# EAGLE design Carriage Minifit PCB (EAGLE 9.6.2)
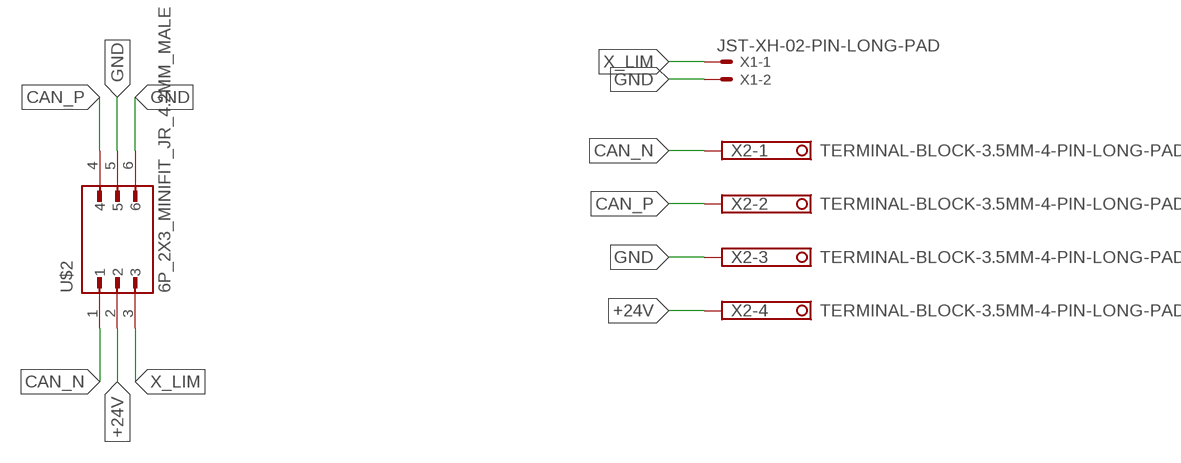
[diagram p0: schematic, sheet 1]

## Parts
U$2  6P_2X3_MINIFIT_JR_4.2MM_MALE  [6P_2X3_MINIFIT_JR_4.2MM_MALE]
X1  JST-XH-02-PIN-LONG-PAD  [JST-XH-02-PACKAGE-LONG-PAD]
X2  TERMINAL-BLOCK-3.5MM-4-PIN-LONG-PAD  [TERMINAL-BLOCK-4-PIN-3.5MM-LONG-PAD]

## Nets
+24V: U$2.2 X2.4
CAN_N [CAN Bus]: U$2.1 X2.1
CAN_P [CAN Bus]: U$2.4 X2.2
GND: U$2.5 U$2.6 X1.2 X2.3
X_LIM: U$2.3 X1.1

## Library data of the parts
U$2 = 6P_2x3_Minifit_Jr_4.2mm_Male:6P_2X3_MINIFIT_JR_4.2MM_MALE
X1 = Rembrandt Electronics - JST XH Connectors v1-0:JST-XH-02-PIN: JST XH Connector 2 Pin Wire to board connector. Pitch: 2,54 mm, (0.100") Number of pins: 2 Created by Rembrandt Electronics www.rembrandtelectronics.com
X2 = Rembrandt Electronics - Terminal Block 3-5mm v1-0:TERMINAL-BLOCK-3.5MM-4-PIN: Terminal Block 3.5mm Pitch: 3,5 mm Number of pins: 4 Created by Rembrandt Electronics www.rembrandtelectronics.com

## Board
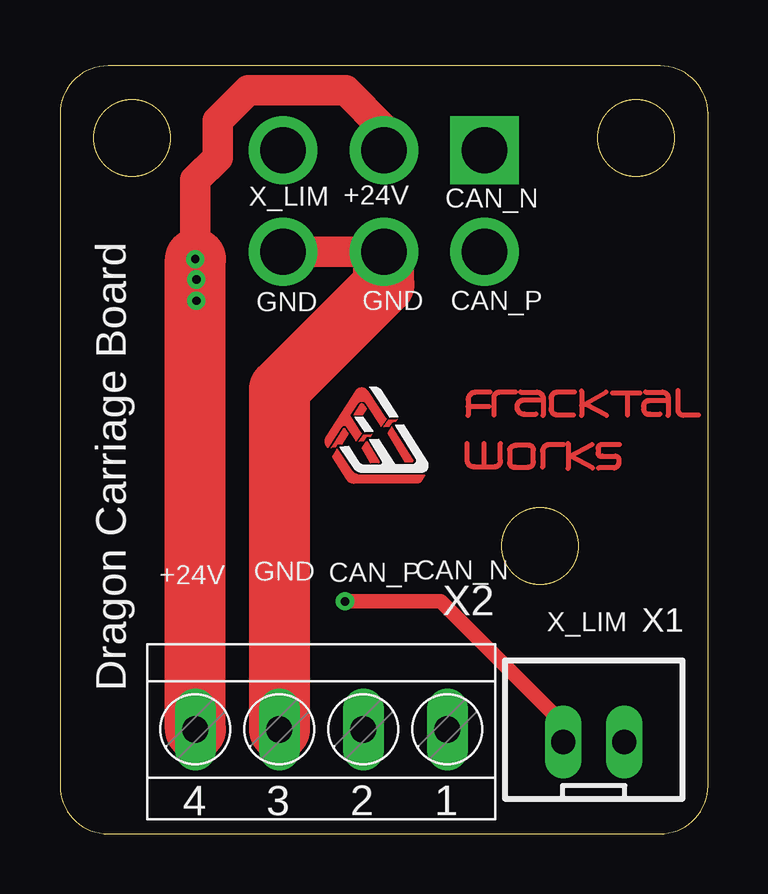
[diagram p1: board, top side]
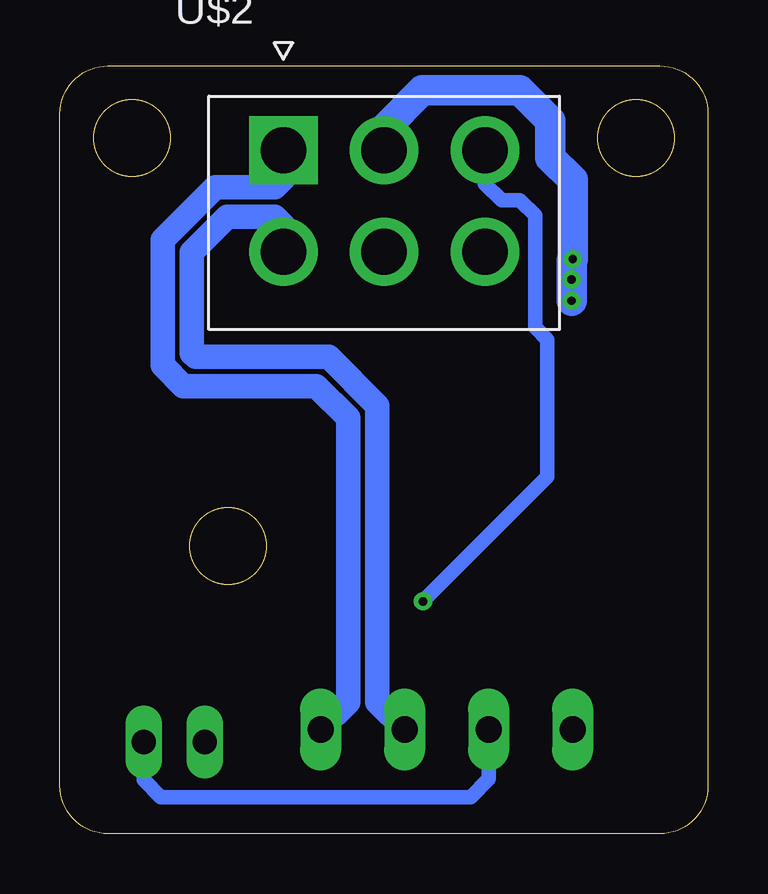
[diagram p2: board, bottom side, seen from below]

Size 27 x 32 mm. Coordinates in mm from the lower left corner, seen from the top.
Outline: 25,0 arc90 27,2 27,30 arc90 25,32 2,32 arc90 0,30 0,2 arc90 2,0 25,0
Outline: circle at 20,12 radius 1.6
Outline: circle at 24,29 radius 1.6
Outline: circle at 3,29 radius 1.6
Copper layers (1*16): Top 0.035mm / dielectric 1.5mm / Bottom 0.035mm
Design rules "LionCircuits *": minimum track width 8mil, minimum drill 0.35mm, track to track 8mil, track to pad 8mil, pad to pad 8mil, via to via 8mil, smd to smd 8mil, copper to edge 10mil, drill to drill 10mil, minimum pad ring 10mil, minimum via ring 8mil, stop-mask expansion 4mil, vias tented up to drill 0mil, thermal gap 10mil

### Footprints (pad centres in the part's own frame; a part is rotated, then mirrored left to right if it is on the bottom)
6P_2X3_MINIFIT_JR_4.2MM_MALE = drill 1.9 pad 2.4 square: 1 0,0 | drill 1.9 pad 2.4: 2 4.2,0; 3 8.4,0; 4 0,-4.23; 5 4.2,-4.23; 6 8.4,-4.23
JST-XH-02-PACKAGE-LONG-PAD = drill 1.016 long: 1 -1.27,0; 2 1.27,0
TERMINAL-BLOCK-4-PIN-3.5MM-LONG-PAD = drill 1.1 pad 1.7 long: 1 -5.25,-0.1; 2 -1.75,-0.1; 3 1.75,-0.1; 4 5.25,-0.1

### Placement (x,y rotation side)
U$1  FWLOGO_SMALL_FOOTPRINT  [FWLOGO_SMALL]  10.81,13.47 0 top
U$2  17.69,28.48 0 bottom
X1  22.24,3.82 0 top
X2  10.89,4.25 180 top

### Tracks (layer width: path | path; a pad name or v marks a point on that pad's centre or on a via)
+24V  (via drill 0.35)
  Top 1.27: v5.64,23.94 5.64,27.25 6.57,28.18 6.57,29.7 7.84,30.97 11.9,30.97 13.49,29.38 U$2.2
  Top 2.54: X2.4 v5.64,23.94
  Bottom 1.27: U$2.2 13.49,29.38 11.9,30.97 7.84,30.97 6.57,29.7 6.57,28.18 5.64,27.25 v5.64,23.94 5.68,23.9 v5.68,23.1 v5.68,22.21
CAN_N
  Bottom 1.016: X2.1 15,5.49 15,17.33 16.32,18.65 21.86,18.65 22.72,19.52 22.72,24.75 20.54,26.93 18.05,26.93 17.69,27.29 U$2.1
CAN_P
  Bottom 1.016: X2.2 13.78,5.49 13.78,17.84 15.81,19.87 21.35,19.87 21.5,20.03 21.5,24.24 20.03,25.71 18.05,25.71 17.69,25.36 U$2.4
GND
  Top 1.27: U$2.5 U$2.6
  Top 2.54: X2.3 9.14,18.53 13.49,22.89 U$2.5
  Bottom 0.61: X1.2 23.51,2.25 22.8,1.53 9.9,1.53 9.14,2.29 X2.3
X_LIM  (via drill 0.35)
  Top 0.61: v11.88,9.69 15.86,9.69 20.97,4.58 X1.1
  Bottom 0.61: v11.88,9.69 6.7,14.87 6.7,20.59 7.2,21.1 7.2,25.77 7.84,26.4 8.6,26.4 9.29,27.09 U$2.3

### Text on the board
tNames: X_LIM | +24V | CAN_N | GND | GND | CAN_P | +24V | GND | CAN_P | CAN_N | X_LIM | Dragon Carriage Board